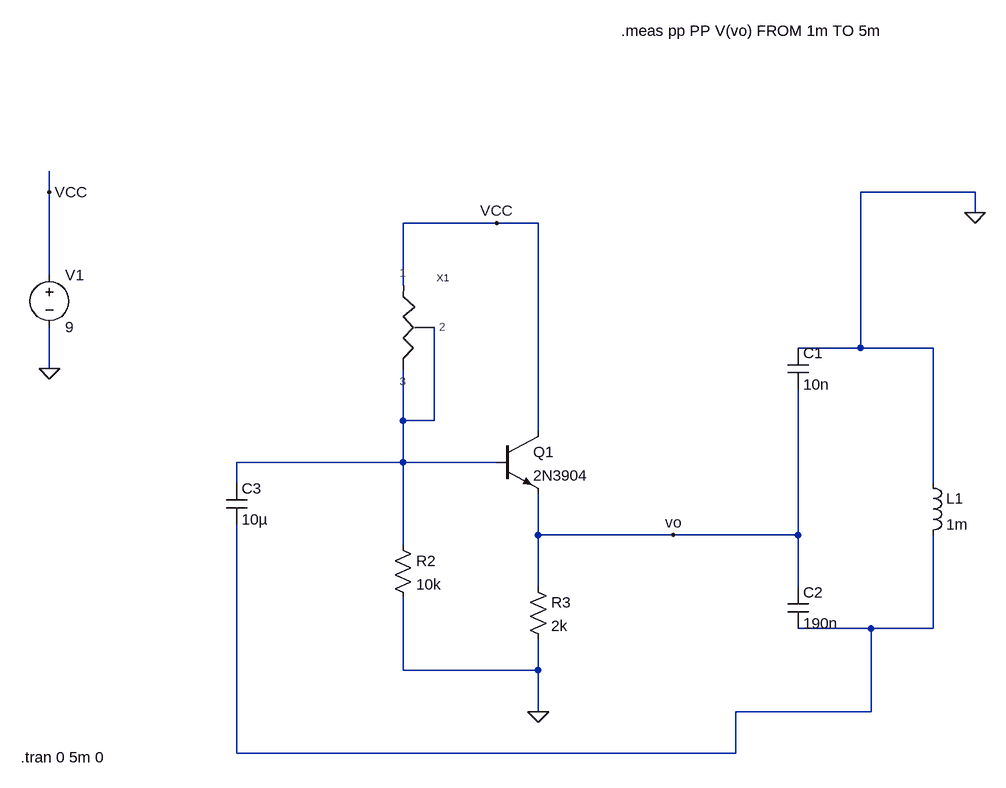
[diagram p0: schematic 2_21.asc]
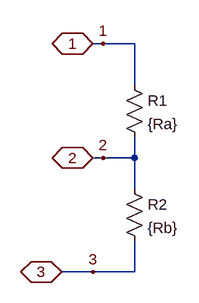
[diagram p1: sub-circuit dian_wei_qi.asc]
2_21.asc, the LTspice schematic file:
Version 4
SHEET 1 932 680
WIRE -512 -272 -512 -304
WIRE 912 -272 736 -272
WIRE 912 -240 912 -272
WIRE 176 -224 32 -224
WIRE 240 -224 176 -224
WIRE -512 -144 -512 -272
WIRE 32 -128 32 -224
WIRE 736 -32 736 -272
WIRE 736 -32 640 -32
WIRE 848 -32 736 -32
WIRE -512 0 -512 -64
WIRE 32 80 32 0
WIRE 80 80 80 -64
WIRE 80 80 32 80
WIRE 240 96 240 -224
WIRE 32 144 32 80
WIRE 32 144 -224 144
WIRE 176 144 32 144
WIRE -224 176 -224 144
WIRE 848 176 848 -32
WIRE 240 256 240 192
WIRE 448 256 240 256
WIRE 640 256 640 32
WIRE 640 256 448 256
WIRE 32 272 32 144
WIRE 240 336 240 256
WIRE 640 336 640 256
WIRE 752 400 640 400
WIRE 848 400 848 256
WIRE 848 400 752 400
WIRE 32 464 32 352
WIRE 240 464 240 416
WIRE 240 464 32 464
WIRE 240 528 240 464
WIRE 752 528 752 400
WIRE 752 528 544 528
WIRE -224 592 -224 240
WIRE 544 592 544 528
WIRE 544 592 -224 592
FLAG 240 528 0
FLAG 912 -240 0
FLAG 176 -224 VCC
FLAG 448 256 vo
FLAG -512 0 0
FLAG -512 -272 VCC
SYMBOL npn 176 96 R0
SYMATTR InstName Q1
SYMATTR Value 2N3904
SYMBOL res 16 256 R0
SYMATTR InstName R2
SYMATTR Value 10k
SYMBOL res 224 320 R0
SYMATTR InstName R3
SYMATTR Value 2k
SYMBOL cap 624 -32 R0
SYMATTR InstName C1
SYMATTR Value 10n
SYMBOL cap 624 336 R0
SYMATTR InstName C2
SYMATTR Value 190n
SYMBOL ind 832 160 R0
SYMATTR InstName L1
SYMATTR Value 1m
SYMBOL cap -240 176 R0
SYMATTR InstName C3
SYMATTR Value 10µ
SYMBOL voltage -512 -160 R0
WINDOW 123 0 0 Left 0
WINDOW 39 0 0 Left 0
SYMATTR InstName V1
SYMATTR Value 9
SYMBOL dian_wei_qi 16 -64 R0
SYMATTR InstName X1
SYMATTR SpiceLine Ra=50k,Rb=10k
TEXT -556 598 Left 2 !.tran 0 5m 0
TEXT 368 -520 Left 2 !.meas pp PP V(vo) FROM 1m TO 5m

dian_wei_qi.asc, the sub-circuit schematic file:
Version 4
SHEET 1 880 680
WIRE 144 -32 128 -32
WIRE 192 -32 144 -32
WIRE 192 32 192 -32
WIRE 144 144 128 144
WIRE 192 144 192 112
WIRE 192 144 144 144
WIRE 192 192 192 144
WIRE 128 320 80 320
WIRE 192 320 192 272
WIRE 192 320 128 320
FLAG 144 -32 1
FLAG 144 144 2
FLAG 128 320 3
FLAG 128 -32 1
IOPIN 128 -32 BiDir
FLAG 128 144 2
IOPIN 128 144 BiDir
FLAG 80 320 3
IOPIN 80 320 BiDir
SYMBOL res 176 16 R0
SYMATTR InstName R1
SYMATTR Value {Ra}
SYMBOL res 176 176 R0
SYMATTR InstName R2
SYMATTR Value {Rb}

The netlist it stands for:
* 2_21.asc
Q1 VCC N001 vo 0 2N3904
R2 N001 0 10k
R3 vo 0 2k
C1 0 vo 10n
C2 vo N002 190n
L1 0 N002 1m
C3 N001 N002 10µ
V1 VCC 0 9
XX1 VCC N001 N001 dian_wei_qi params: Ra=50k,Rb=10k

* block symbol definitions
.subckt dian_wei_qi 1 2 3
R1 1 2 {Ra}
R2 2 3 {Rb}
.ends dian_wei_qi

.model NPN NPN
.model PNP PNP
.lib standard.bjt
.tran 0 5m 0
.meas pp PP V(vo) FROM 1m TO 5m
.backanno
.end